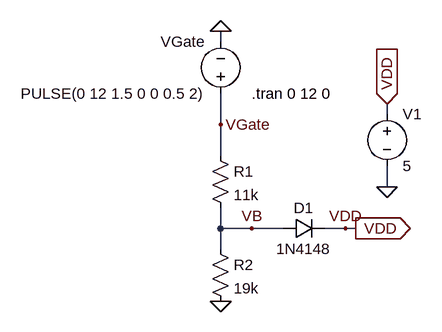
[diagram p0: schematic VGate.asc]
VGate.asc, the LTspice schematic file:
Version 4
SHEET 1 948 680
WIRE 96 -112 96 -128
WIRE 352 0 352 -16
WIRE 96 16 96 -32
WIRE 96 64 96 16
WIRE 352 112 352 80
WIRE 96 176 96 144
WIRE 144 176 96 176
WIRE 192 176 144 176
WIRE 288 176 256 176
WIRE 304 176 288 176
WIRE 96 208 96 176
FLAG 96 288 0
FLAG 96 -128 0
FLAG 288 176 VDD
FLAG 96 16 VGate
FLAG 144 176 VB
FLAG 352 112 0
FLAG 352 -16 VDD
IOPIN 352 -16 In
FLAG 304 176 VDD
IOPIN 304 176 Out
SYMBOL res 80 48 R0
SYMATTR InstName R1
SYMATTR Value 11k
SYMBOL res 80 192 R0
SYMATTR InstName R2
SYMATTR Value 19k
SYMBOL diode 192 192 R270
WINDOW 0 32 32 VTop 2
WINDOW 3 0 32 VBottom 2
SYMATTR InstName D1
SYMATTR Value 1N4148
SYMBOL voltage 96 -16 R180
WINDOW 0 24 96 Left 2
WINDOW 3 24 16 Left 2
WINDOW 123 0 0 Left 0
WINDOW 39 0 0 Left 0
SYMATTR InstName VGate
SYMATTR Value PULSE(0 12 1.5 0 0 0.5 2)
SYMBOL voltage 352 -16 R0
WINDOW 123 0 0 Left 0
WINDOW 39 0 0 Left 0
SYMATTR InstName V1
SYMATTR Value 5
TEXT 144 -32 Left 2 !.tran 0 12 0

The netlist it stands for:
* VGate.asc
R1 VGate VB 11k
R2 VB 0 19k
D1 VB VDD 1N4148
VGate VGate 0 PULSE(0 12 1.5 0 0 0.5 2)
V1 VDD 0 5
.model D D
.lib standard.dio
.tran 0 12 0
.backanno
.end

* Results of the author's LTspice run, read from the files saved beside the schematic
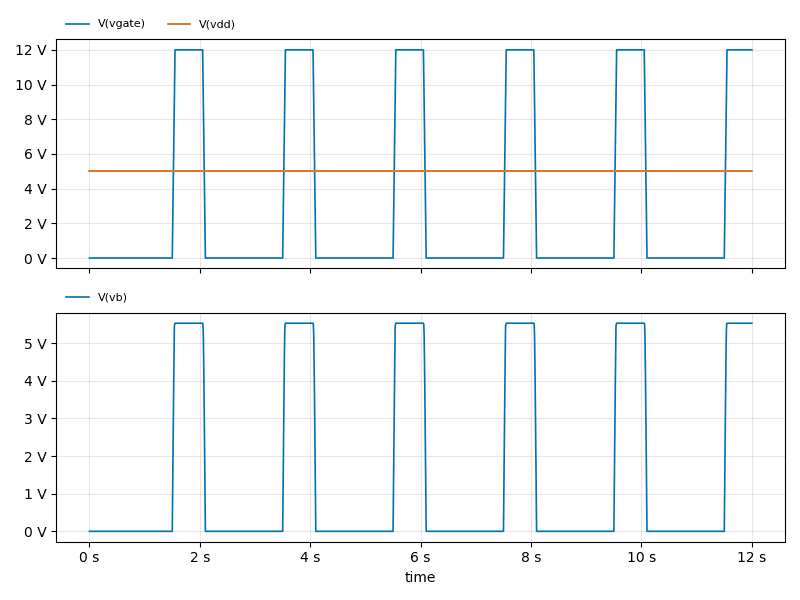
[diagram p1: Transient Analysis of VGate.asc, plotted from the saved traces]
* Transient Analysis, 1 run:
*   V(vgate): min 0 V, max 12 V, average 3.225 V, rms 6.139 V, last 12 V
*   V(vdd): min 5 V, max 5 V, average 5 V, rms 5 V, last 5 V
*   V(vb): min 17.59 µV, max 5.531 V, average 1.518 V, rms 2.87 V, last 5.529 V